# EAGLE design Sparkfun_Adjustable_LiPo_Charger (EAGLE 7.7.0)
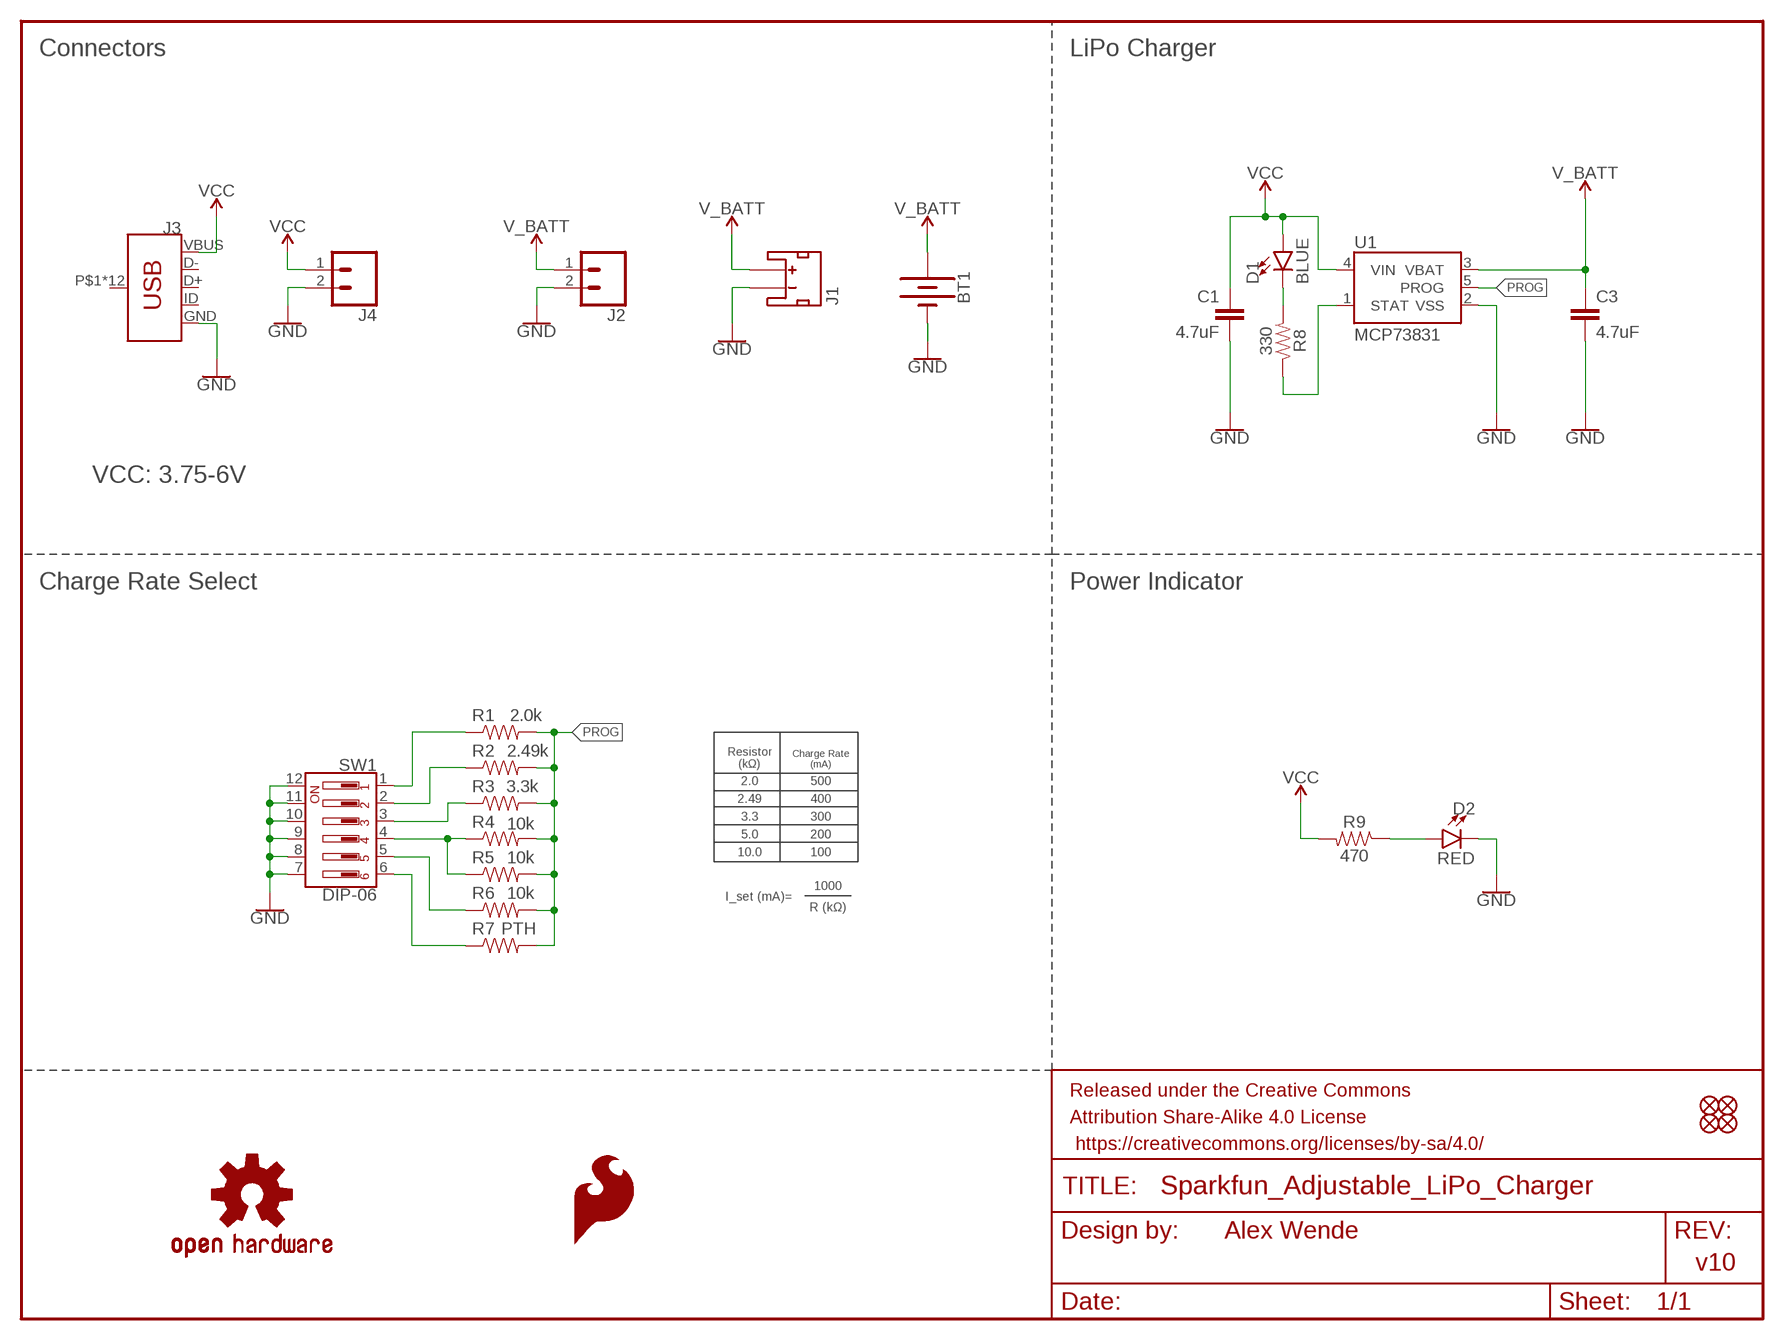
[diagram p0: schematic, sheet 1]

## Parts
BT1  BATTERY-24.5MM_SMD  [BATTCON_24.5MM_SMD]
C1  4.7uF  4.7UF0603  [0603]
C3  4.7uF  4.7UF0603  [0603]
D1  BLUE  LED-BLUE0603  [LED-0603]
D2  RED  LED-RED0603  [LED-0603]
FD1  FIDUCIALUFIDUCIAL  [FIDUCIAL-MICRO]
FD2  FIDUCIALUFIDUCIAL  [FIDUCIAL-MICRO]
FD3  FIDUCIALUFIDUCIAL  [FIDUCIAL-MICRO]
FD4  FIDUCIALUFIDUCIAL  [FIDUCIAL-MICRO]
FRAME1  FRAME-LETTER  [CREATIVE_COMMONS]
J1  JST_2MM_MALE  [JST-2-SMD]
J2  CONN_021X02_NO_SILK  [1X02_NO_SILK]
J3  USB_MICRO-B_HALF_PTH  [USB-MICROB-PTH]
J4  CONN_021X02_NO_SILK  [1X02_NO_SILK]
LOGO1  SFE_LOGO_FLAME.1_INCH  [SFE_LOGO_FLAME_.1]
LOGO2  OSHW-LOGOS  [OSHW-LOGO-S]
R1  2.0k  2.0KOHM-0603-1/10W-5%  [0603]
R2  2.49k  2.49KOHM-0603-1/10W-1%  [0603]
R3  3.3k  3.3KOHM-0603-1/10W-1%  [0603]
R4  10k  10KOHM-0603-1/10W-1%  [0603]
R5  10k  10KOHM-0603-1/10W-1%  [0603]
R6  10k  10KOHM-0603-1/10W-1%  [0603]
R7  PTH  RESISTORAXIAL-0.3  [AXIAL-0.3]
R8  330  330OHM-0603-1/10W-1%  [0603]
R9  470  470OHM-0603-1/10W-1%  [0603]
SW1  DIP-06  [DIPSWITCH-06-SMD]
U1  MCP73831  [SOT23-5]

## Nets
GND: BT1.2(-) C1.2 C3.2 D2.C J1.1(-) J2.2 J3.GND J4.2 SW1.7 SW1.8 SW1.9 SW1.10 SW1.11 SW1.12 U1.2(VSS)
N$1: R8.1 U1.1(STAT)
N$2: R1.1 SW1.1
N$3: R2.1 SW1.2
N$4: R3.1 SW1.3
N$5: R4.1 R5.1 SW1.4
N$6: R6.1 SW1.5
N$7: R7.P$1 SW1.6
N$8: D1.C R8.2
N$12: D2.A R9.1
PROG: R1.2 R2.2 R3.2 R4.2 R5.2 R6.2 R7.P$2 U1.5(PROG)
V_BATT: BT1.3(+) C3.1 J1.2(+) J2.1 U1.3(VBAT)
VCC: C1.1 D1.A J3.VBUS J4.1 R9.2 U1.4(VIN)
Unconnected: J1.NC1(PAD1) J1.NC2(PAD2) J3.D+ J3.D- J3.ID J3.P$1(SHIELD) J3.P$2(SHIELD) J3.P$3(SHIELD) J3.P$4(SHIELD) J3.P$6(SHIELD) J3.P$8(SHIELD) J3.P$10(SHIELD) J3.P$12(SHIELD) J3.SHEILD2(SHIELD) J3.SHIELD J3.SHIELD3(SHIELD) J3.SHIELD4(SHIELD)

## Notes on the sheet
- Connectors | LiPo Charger
- VCC: 3.75-6V
- Charge Rate Select | Power Indicator
- Resistor
  (kΩ)
- Charge Rate
  (mA)
- 2.0 | 500
- 2.49 | 400
- 3.3 | 300
- 5.0 | 200
- 10.0 | 100
- 1000
- I_set (mA)=
- R (kΩ)
- Alex Wende
- v10

## Library data of the parts
BT1 = SparkFun-Batteries:BATTERY: Battery - Single Cell A variety of battery chemistries, sizes, and footprints. Device List: 20MM_PTH - Coin Cell Battery Holder - 20mm (PTH) <https://www.sparkfun.com/products/783> 6.8MM_PTH - Coin Cell Battery Holder - 6.8MM(SMD) <https://www.digikey.com/product-detail/en/seiko-instruments/MS621FE-FL11E/728-1057-ND/1889208?WT.srch=1&gclid=CNOQ5a6LzdQCFZS2wAodXCkE0g> 12MM_SMD - Coin Cell Battery Holder - 12mm (SMD) <https://www.sparkfun.com/products/10592> 12MM_PTH - Coin Cell Battery Holder - 12mm (PTH) <https://www.sparkfun.com/products/7948> 20MM_SMD - 20mm Coin Cell Battery Holder (SMD) (2 legs) Used on the Big Time Watch Kit <https://www.sparkfun.com/products/11734> 20MM_SMD_4LEGS - Coin Cell Battery Holder - 20mm (SMD) <https://www.sparkfun.com/products/11892> 20MM_SMD_4LEGS_OVERPASTE - Coin Cell Battery Holder - 20mm (SMD) <https://www.sparkfun.com/products/11892> (Over-paste on the legs) 24.5MM_PTH - Coin Cell Battery Holder - 24.5mm (PTH) <https://www.sparkfun.com/products/8863> 9V - 9V Battery Holder - PC Mount Used on the SparkFun SparkPunk Sound Kit <https://www.sparkfun.com/products/11177> and SparkFun SparkPunk Sequencer Kit <https://www.sparkfun.com/products/12707> 18650 - Battery Holder - 18650 (PTH) <https://www.sparkfun.com/products/13113> AA - Battery Holder - 1xAA (PTH) <https://www.sparkfun.com/products/7949> AAA - Battery Holder - 1xAAA (PTH) <https://www.sparkfun.com/products/12718> AA_KIT - Battery Holder - 1xAA (PTH) <https://www.sparkfun.com/products/7949> Special kit package - pads only have exposed copper on one side of the board. AAA_KIT - Battery Holder - 1xAAA (PTH) <https://www.sparkfun.com/products/12718> Special kit package - pads only have exposed copper on one side of the board.; PROD_ID: PRT-13755
C1 C3 = SparkFun-Capacitors:4.7UF: 4.7µF ceramic capacitors A capacitor is a passive two-terminal electrical component used to store electrical energy temporarily in an electric field.; PROD_ID: CAP-08280
D1 = SparkFun-LED:LED-BLUE: Blue SMD LED Used in manufacturing of various products at SparkFun Packages: 0603 - SMD 0603 package [Product Link] <http://www.digikey.com/product-detail/en/SMLE12BC7TT86/511-1589-2-ND/1641808> 1206 - SMD1206 package [Product Link] <http://www.digikey.com/product-detail/en/lite-on-inc/LTST-C150TBKT/160-1643-1-ND/573584> SparkFun Products: ESP8266 Thing-Dev Board <https://www.sparkfun.com/products/13711> RedBoard <https://www.sparkfun.com/products/12757>; PROD_ID: DIO-08575
D2 = SparkFun-LED:LED-RED: Red SMD LED Used in manufacturing of most products at SparkFun Packages: 0603 - SMD 0603 package [Product Link] <http://docs.avagotech.com/docs/AV02-0551EN> 0603 SMART - SMD 0603 SMART package ( more efficient and expensive)[Product Link] <http://www.osram-os.com/Graphics/XPic2/00077099_0.pdf> 1206 - SMD1206 package [Product Link] <https://www.sparkfun.com/datasheets/DevTools/LilyPad/Q150OVS4.pdff> SparkFun Products: Pro Mini 328 -5V <https://www.sparkfun.com/products/821> RedBoard <https://www.sparkfun.com/products/12757> IOIO-OTG <https://www.sparkfun.com/products/13613>; PROD_ID: DIO-00819
FD1-FD4 = SparkFun-Aesthetics:FIDUCIAL: Fiducial Alignment Points Point-of-reference for pick-and-place machines and other optical instruments.
FRAME1 = SparkFun-Aesthetics:FRAME-LETTER: Schematic Frame - Letter Standard 8.5x11 US Letter frame
J1 = SparkFun-Connectors:JST_2MM_MALE: JST 2MM MALE RA CONNECTOR Two pin, compact surface mount connector. Commonly used as a battery input connection point. We really like the solid locking feeling and high current rating on these small connectors. We use these all the time as battery connectors. Mates to single-cell LiPo batteries. Here is the connector we sell at SparkFun: JST Right Angle Connector - White <https://www.sparkfun.com/products/8612> (PRT-08612) Datasheet <http://www.sparkfun.com/datasheets/Prototyping/Connectors/JST-Horizontal.pdf> It was used on these SparkFun products: SparkFun MOSFET Power Controller <https://www.sparkfun.com/products/11214> (PRT-11214) SparkFun Battery Babysitter - LiPo Battery Manager <https://www.sparkfun.com/products/13777> (PRT-13777) And many, many others that required a lipo battery connection.; PROD_ID: CONN-11443; SF_ID: PRT-08612
J2 J4 = SparkFun-Connectors:CONN_02: Multi connection point. Often used as Generic Header-pin footprint for 0.1 inch spaced/style header connections On any of the 0.1 inch spaced packages, you can populate with these: Break Away Headers - Straight <https://www.sparkfun.com/products/116> (PRT-00116) Break Away Male Headers - Right Angle <https://www.sparkfun.com/products/553> (PRT-00553) Female Headers <https://www.sparkfun.com/products/115> (PRT-00115) Break Away Headers - Machine Pin <https://www.sparkfun.com/products/117> (PRT-00117) Break Away Female Headers - Swiss Machine Pin <https://www.sparkfun.com/products/743> (PRT-00743) For SCREWTERMINALS and SPRING TERMINALS visit here: Screw Terimnals on SparkFun.com <https://www.sparkfun.com/search/results?term=Screw+Terminals> (5mm/3.5mm/2.54mm spacing) This device is also useful as a general connection point to wire up your design to another part of your project. Our various solder wires solder well into these plated through hole pads. Hook-Up Wire - Assortment (Stranded, 22 AWG) <https://www.sparkfun.com/products/11375> (PRT-11375) Hook-Up Wire - Assortment (Solid Core, 22 AWG) <https://www.sparkfun.com/products/11367> (PRT-11367) View the entire wire category on our website here <https://www.sparkfun.com/categories/141> Special notes: Molex polarized connector foot print use with: PRT-08233 with associated crimp pins and housings. 2.54_SCREWTERM for use with PRT-10571. 3.5mm Screw Terminal footprints for PRT-08084 5mm Screw Terminal footprints for use with PRT-08432
J3 = SparkFun-Connectors:USB_MICRO-B: USB Type Micro-B Connector Male/female and PTH/SMT variants SparkFun Products: SparkFun microB USB Breakout <https://www.sparkfun.com/products/12035> SparkFun USB microB Plug Breakout <https://www.sparkfun.com/products/10031> SparkFun ESP8266 Thing <https://www.sparkfun.com/products/13231>; PROD_ID: CONN-13711; VALUE: AMP FCI 10103594-0001LF
LOGO1 = SparkFun-Aesthetics:SFE_LOGO_FLAME: SparkFun Flame Logo This is the SparkFun flame logo. The logo on the schematic will always be the same size; the package variant is the height of the flame. Default layer for the logo on the board is tSilk.
LOGO2 = SparkFun-Aesthetics:OSHW-LOGO: Open-Source Hardware (OSHW) Logo This logo indicates the piece of hardware it is found on incorporates a OSHW license and/or adheres to the definition of open source hardware found here: http://freedomdefined.org/OSHW
R1 = SparkFun-Resistors:2.0KOHM: 2kΩ resistor A resistor is a passive two-terminal electrical component that implements electrical resistance as a circuit element. Resistors act to reduce current flow, and, at the same time, act to lower voltage levels within circuits. - Wikipedia; PROD_ID: RES-08296
R2 = SparkFun-Resistors:2.49KOHM: 2.49kΩ resistor A resistor is a passive two-terminal electrical component that implements electrical resistance as a circuit element. Resistors act to reduce current flow, and, at the same time, act to lower voltage levels within circuits. - Wikipedia; PROD_ID: RES-09568
R3 = SparkFun-Resistors:3.3KOHM: 3.3kΩ resistor A resistor is a passive two-terminal electrical component that implements electrical resistance as a circuit element. Resistors act to reduce current flow, and, at the same time, act to lower voltage levels within circuits. - Wikipedia; PROD_ID: RES-07851
R4-R6 = SparkFun-Resistors:10KOHM: 10kΩ resistor A resistor is a passive two-terminal electrical component that implements electrical resistance as a circuit element. Resistors act to reduce current flow, and, at the same time, act to lower voltage levels within circuits. - Wikipedia; PROD_ID: RES-00824
R7 = SparkFun-Resistors:RESISTOR: Generic Resistor Package
R8 = SparkFun-Resistors:330OHM: 330Ω resistor A resistor is a passive two-terminal electrical component that implements electrical resistance as a circuit element. Resistors act to reduce current flow, and, at the same time, act to lower voltage levels within circuits. - Wikipedia; PROD_ID: RES-00818
R9 = SparkFun-Resistors:470OHM: 470Ω resistor A resistor is a passive two-terminal electrical component that implements electrical resistance as a circuit element. Resistors act to reduce current flow, and, at the same time, act to lower voltage levels within circuits. - Wikipedia; PROD_ID: RES-07869
SW1 = SparkFun-Switches:DIP-06; PROD_ID: SWCH-13756
U1 = SparkFun-IC-Power:MCP73831: MCP73831T Li-Ion, Li-Pol Controller Miniature single cell, fully integrated Li-Ion, Li-polymer charge management controller Datasheet <http://ww1.microchip.com/downloads/en/DeviceDoc/20001984g.pdf> SparkFun Products: SparkFun ESP32 Thing <https://www.sparkfun.com/products/13907> SparkFun 9DoF Razor IMU M0 <https://www.sparkfun.com/products/14001>; PROD_ID: IC-09995

## Board
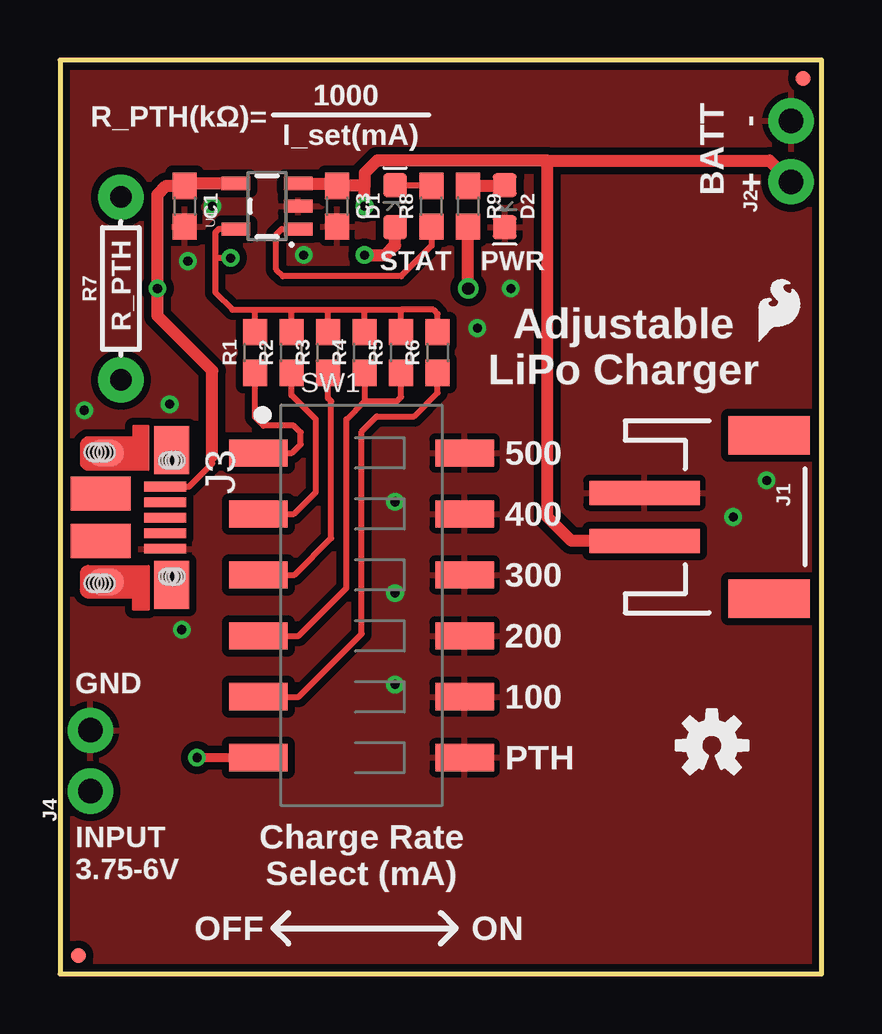
[diagram p1: board, top side]
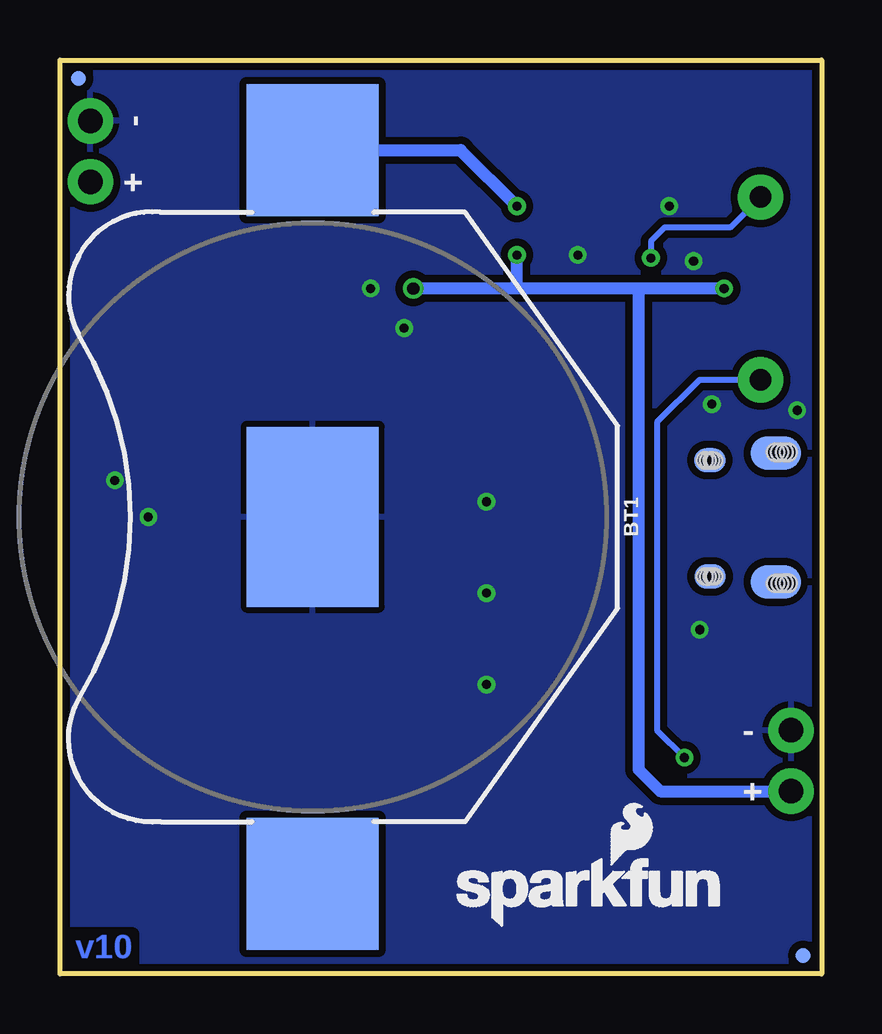
[diagram p2: board, bottom side, seen from below]

Size 31.75 x 38.1 mm. Coordinates in mm from the lower left corner, seen from the top.
Outline: 0,0 31.75,0 31.75,38.1 0,38.1 0,0
Copper layers (1*16): Top 0.035mm / dielectric 1.5mm / Bottom 0.035mm
Design rules "SparkFun-2-layer-TIGHT": minimum track width 7mil, minimum drill 15mil, track to track 7mil, track to pad 7mil, pad to pad 7mil, via to via 7mil, smd to smd 7mil, copper to edge 7mil, drill to drill 7mil, minimum pad ring 7mil, minimum via ring 7mil, stop-mask expansion 4mil, vias tented up to drill 25mil, thermal gap 10mil

### Footprints (pad centres in the part's own frame; a part is rotated, then mirrored left to right if it is on the bottom)
BATTCON_24.5MM_SMD = smd 5.5 x 5.5: 1 -15.3,0; 3 15.3,0 | smd 7.5 x 5.5: 2 0,0
0603 = smd 1.1 x 1: 1 -0.85,0; 2 0.85,0
LED-0603 = smd 1 x 1: A -0.877,0; C 0.877,0
FIDUCIAL-MICRO = smd 0.635 x 0.635: 1 0,0
JST-2-SMD = smd 1 x 4.6: 1 -1,-3.7; 2 1,-3.7 | smd 1.6 x 3.4: NC1 -3.4,1.5; NC2 3.4,1.5
1X02_NO_SILK = drill 1.016 pad 1.88: 1 0,0; 2 2.54,0
USB-MICROB-PTH = smd 0.4 x 1.75: D+ 0.031,1.331; D- -0.619,1.331; GND 1.331,1.331; ID 0.681,1.331; VBUS -1.269,1.331 | smd 1.4 x 2.1 bottom: P$1 2.701,-1.142; P$3 -2.659,-1.144 | smd 1 x 1.3: P$2 2.487,1.594; P$6 -2.368,1.604 | smd 1 x 1.3 bottom: P$4 -2.368,1.604; P$10 2.481,1.598 | smd 1.1 x 1.5: P$8 2.701,-1.142; P$12 -2.659,-1.144 | smd 2 x 1.46: SHEILD2 2.831,1.606; SHIELD -2.794,1.606 | smd 1.425 x 2.5: SHIELD3 -0.979,-1.349; SHIELD4 0.996,-1.352 | hole 0.7: -2.693,-1.134; -2.693,-1.3; -2.694,-1.499; -2.694,-1.664; 2.768,-1.134; 2.767,-1.303; 2.766,-1.496; 2.766,-1.664 | hole 0.66: -2.359,1.821; -2.349,1.691; -2.359,1.541; -2.354,1.432; 2.481,1.821; 2.491,1.691; 2.481,1.541; 2.486,1.432
AXIAL-0.3 = drill 0.9 pad 1.88: P$1 -3.81,0; P$2 3.81,0
DIPSWITCH-06-SMD = smd 1.13 x 2.44: 1 -6.35,-4.3; 2 -3.81,-4.3; 3 -1.27,-4.3; 4 1.27,-4.3; 5 3.81,-4.3; 6 6.35,-4.3; 7 6.35,4.3; 8 3.81,4.3; 9 1.27,4.3; 10 -1.27,4.3; 11 -3.81,4.3; 12 -6.35,4.3
SOT23-5 = smd 0.55 x 1.2: 1 -0.95,-1.3; 2 0,-1.3; 3 0.95,-1.3; 4 0.95,1.3; 5 -0.95,1.3

### Placement (x,y rotation side)
BT1  21.21,19.05 90 bottom
C1  5.21,32 270 top
C3  11.56,32 270 top
D1  13.97,32 90 top
D2  18.54,32 270 top
FD1  30.99,37.34 0 top
FD2  0.76,0.76 0 top
FD3  0.76,0.76 0 bottom
FD4  30.99,37.34 0 bottom
FRAME1  -12.7,-20.32 0 top  (outside the outline)
J1  28.07,19.05 270 top
J2  30.48,33.02 90 top
J3  3.05,19.05 270 top
J4  1.27,7.62 90 top
LOGO1  28.83,26.04 0 top
LOGO2  27.18,9.53 0 top
R1  8.13,25.91 90 top
R2  9.65,25.91 90 top
R3  11.18,25.91 90 top
R4  12.7,25.91 90 top
R5  14.22,25.91 90 top
R6  15.75,25.91 90 top
R7  2.54,28.57 90 top
R8  15.49,32 90 top
R9  17.02,32 270 top
SW1  12.57,15.37 270 top
U1  8.64,32 90 top
U$1  [SFE_LOGO_NAME_FLAME_.1]  15.62,1.91 0 bottom

### Tracks (layer width: path | path; a pad name or v marks a point on that pad's centre or on a via)
GND  (via drill 0.38)
  other vias: 10.16,29.97 5.33,29.72 6.35,32 13.97,19.68 13.97,12.06 13.97,15.88 5.08,14.35 1.02,23.5 4.57,23.75 17.4,26.92 18.8,28.57 28.07,19.05 29.46,20.57
  pour Top (isolate 0.305): 0,38.1 31.75,38.1 31.75,0 0,0
  pour Bottom (isolate 0.305): 0,38.1 31.75,38.1 31.75,0 0,0
N$1
  Top 0.254: R8.1 15.49,30.35 14.22,29.08 9.3,29.08 9.02,29.37 9.02,30.82 9.25,31.05 U1.1
N$2
  Top 0.254: SW1.1 9.67,21.72 10.03,22.08 10.03,22.58 9.75,22.86 8.49,22.86 8.13,23.22 R1.1
N$3
  Top 0.254: SW1.2 9.75,19.18 10.67,20.09 10.67,23.11 9.65,24.13 R2.1
N$4
  Top 0.254: SW1.3 9.77,16.64 11.3,18.17 11.3,23.88 11.18,24 R3.1
N$5
  Top 0.254: SW1.4 9.95,14.1 11.94,16.08 11.94,23.11 12.7,23.88 | 12.7,23.88 14.04,23.88 14.22,24.06 R5.1 | R4.1 12.7,23.88
N$6
  Top 0.254: SW1.5 9.96,11.56 12.57,14.18 12.57,22.61 13.21,23.24 14.76,23.24 15.75,24.23 R6.1
N$7  (via drill 0.38)
  Top 0.381: v5.71,9.02 SW1.6
  Bottom 0.254: R7.P$1 5.09,24.77 6.86,23 6.86,10.16 v5.71,9.02
N$8
  Top 0.254: D1.C 15.47,32.88 R8.2
N$12
  Top 0.508: R9.1 18.54,32.85 D2.A
PROG  (via drill 0.38)
  Top 0.254: R1.2 8.13,27.69 | 8.13,27.69 9.65,27.69 | 9.65,27.69 11.18,27.69 | 11.18,27.69 12.7,27.69 | 12.7,27.69 14.22,27.69 | R6.2 15.75,27.51 15.57,27.69 14.22,27.69 | R2.2 9.65,27.69 | R3.2 11.18,27.69 | R4.2 12.7,27.69 | R5.2 14.22,27.69 | U1.5 6.62,31.05 6.48,30.91 6.48,29.84 | 6.48,29.84 6.48,28.4 7.2,27.69 8.13,27.69 | v7.11,29.84 6.48,29.84
  Bottom 0.254: R7.P$2 3.81,31.11 6.54,31.11 7.11,30.55 v7.11,29.84
V_BATT  (via drill 0.38)
  Top 0.508: U1.3 11.56,32.95 C3.1 12.7,32.85 | J1.2 21.33,18.05 20.32,19.06 20.32,33.91 | 20.32,33.91 29.59,33.91 J2.1 | 20.32,33.91 13.22,33.91 12.7,33.38 12.7,32.85 | v12.7,32 12.7,32.85
  Bottom 0.508: BT1.3 15.05,34.35 v12.7,32
VCC  (via drill 0.38, 0.51)
  Top 0.254: J3.VBUS 5.38,20.32 6.35,21.29 6.35,21.59
  Top 0.508: 6.35,21.59 6.35,25.15 4.06,27.43 v4.06,28.57 4.06,32.49 4.43,32.85 C1.1 5.21,32.95 U1.4 | v12.7,29.97 13.57,29.97 13.97,30.37 D1.A | v17.02,28.57 R9.2
  Bottom 0.508: v4.06,28.57 7.62,28.57 | 7.62,28.57 12.7,28.57 | 12.7,28.57 v12.7,29.97 | 7.62,28.57 7.62,8.51 6.73,7.62 J4.1 | 12.7,28.57 v17.02,28.57

### Text on the board
Bottom: v10
tPlace: 1000 | BATT | - | R_PTH(kΩ)= | I_set(mA) | + | R_PTH | STAT | PWR | Adjustable / LiPo Charger | 500 | 400 | 300 | 200 | GND | 100 | PTH | Charge Rate / Select (mA) | INPUT / 3.75-6V | OFF | ON
bPlace: - | + | - | +
Measures: Units are in inches
tDocu: Alex Wende